# EAGLE design PCBFeeder_B_Board (EAGLE 8.4.3)
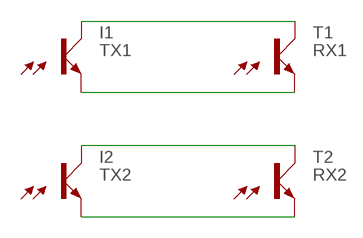
[diagram p0: schematic, sheet 1]

## Parts
I1  TX1  LTR-4206E  [DIODE_BREAKOUT]
I2  TX2  LTR-4206E  [DIODE_BREAKOUT]
T1  RX1  VEMT_2020_PHOTOTRANSISTOR  [VEMT2020_PHOTOTRANSISTOR]
T2  RX2  VEMT_2020_PHOTOTRANSISTOR  [VEMT2020_PHOTOTRANSISTOR]

## Nets
N$1: I1.A T1.A
N$2: I1.C T1.C
N$3: I2.A T2.A
N$4: I2.C T2.C

## Library data of the parts
I1 I2 = EE:LTR-4206E: Silicium NPN Phototransistor Source: Siemens; OC_FARNELL: unknown; OC_NEWARK: unknown
T1 T2 = EE:VEMT_2020_PHOTOTRANSISTOR

## Board
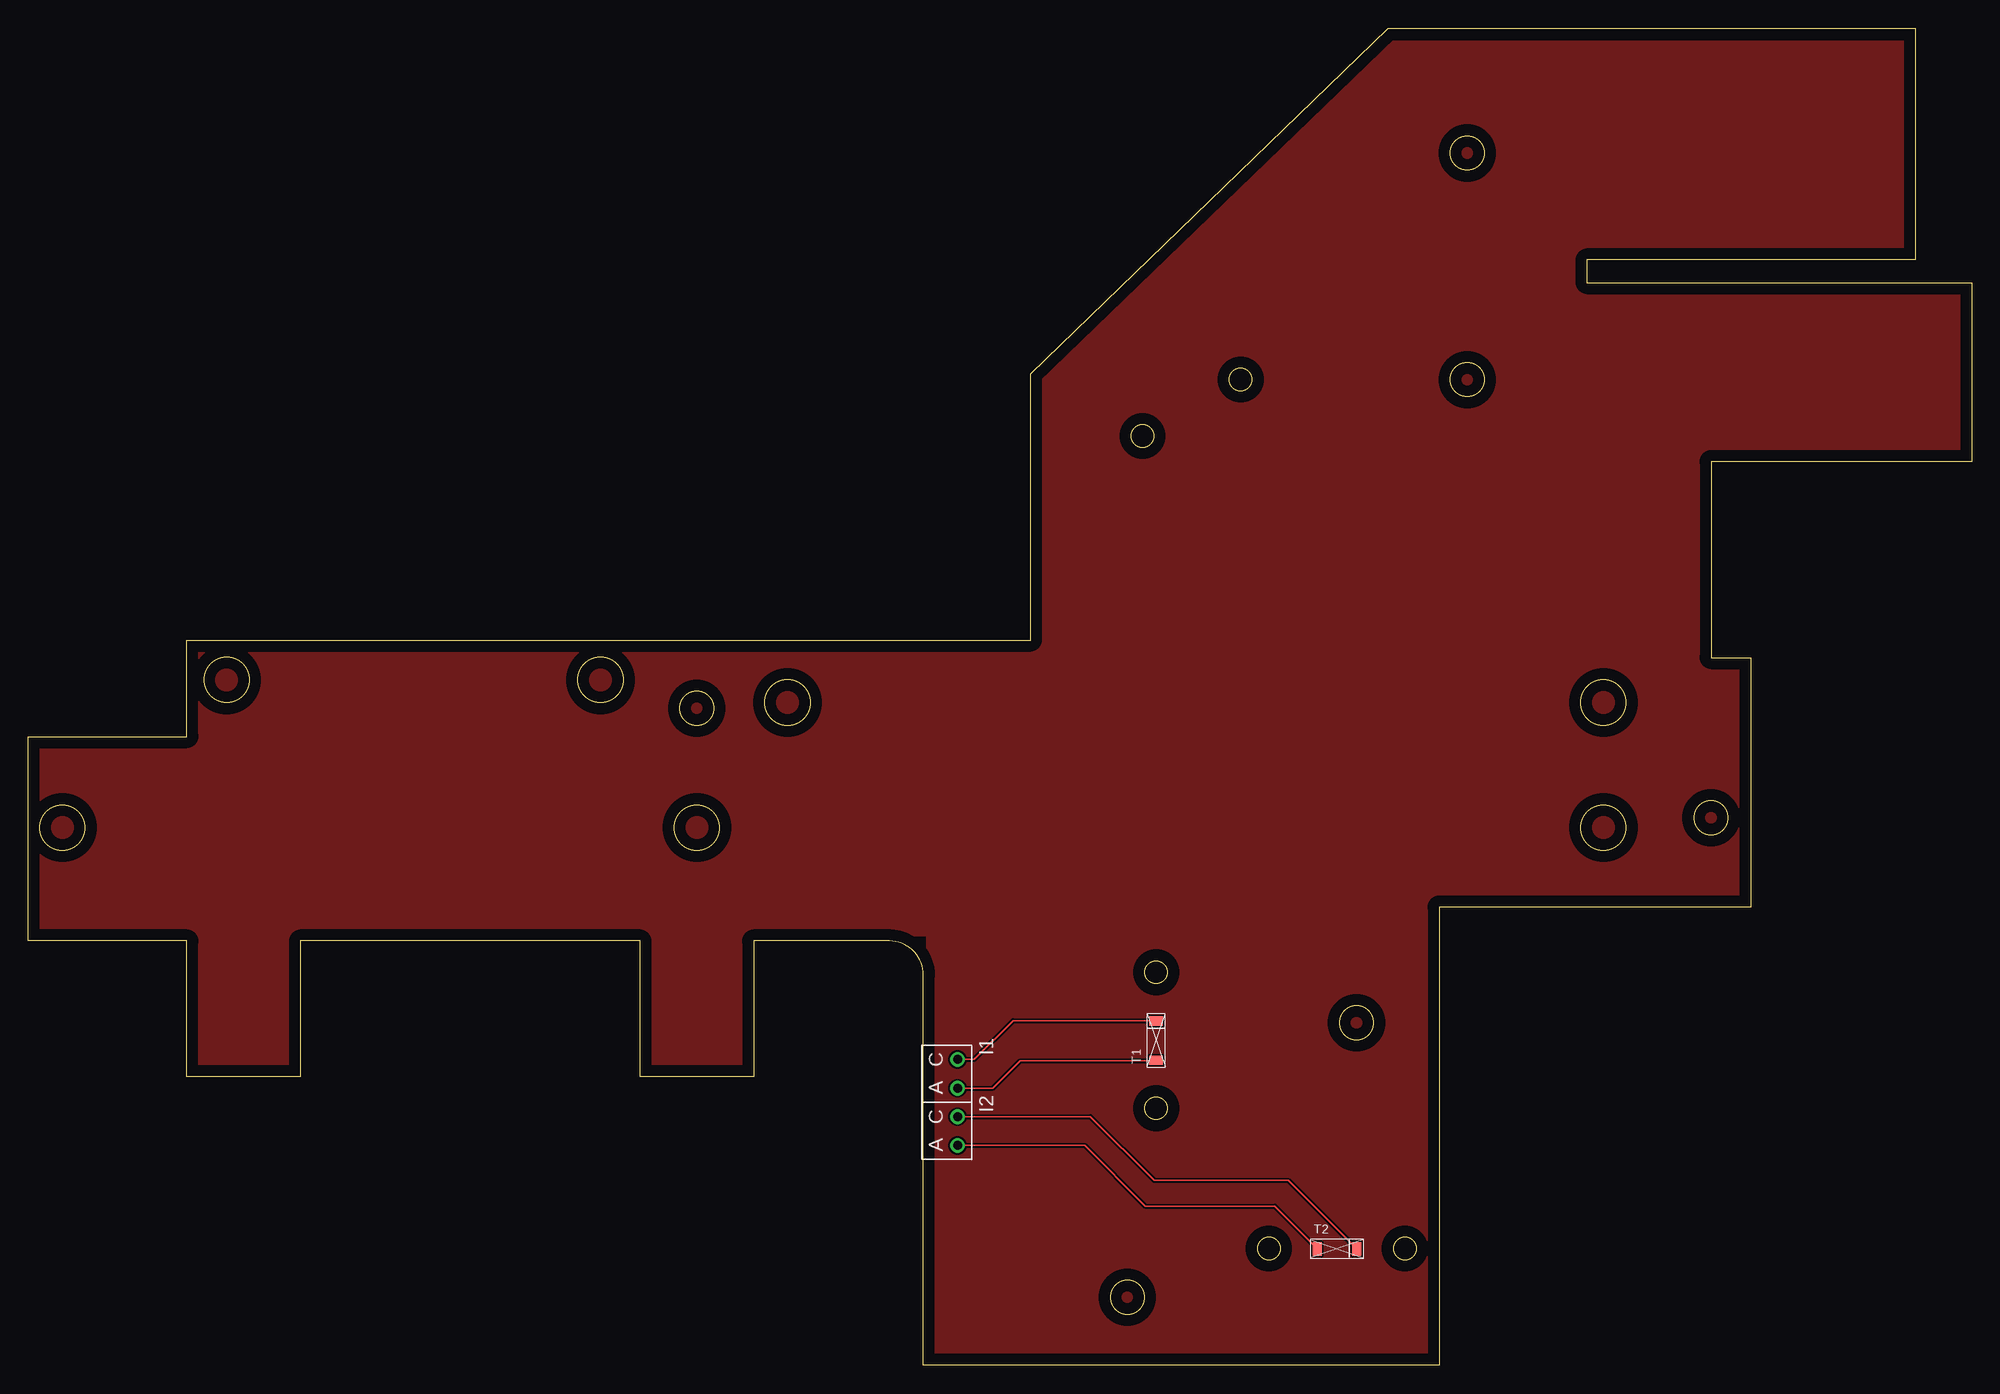
[diagram p1: board, top side]
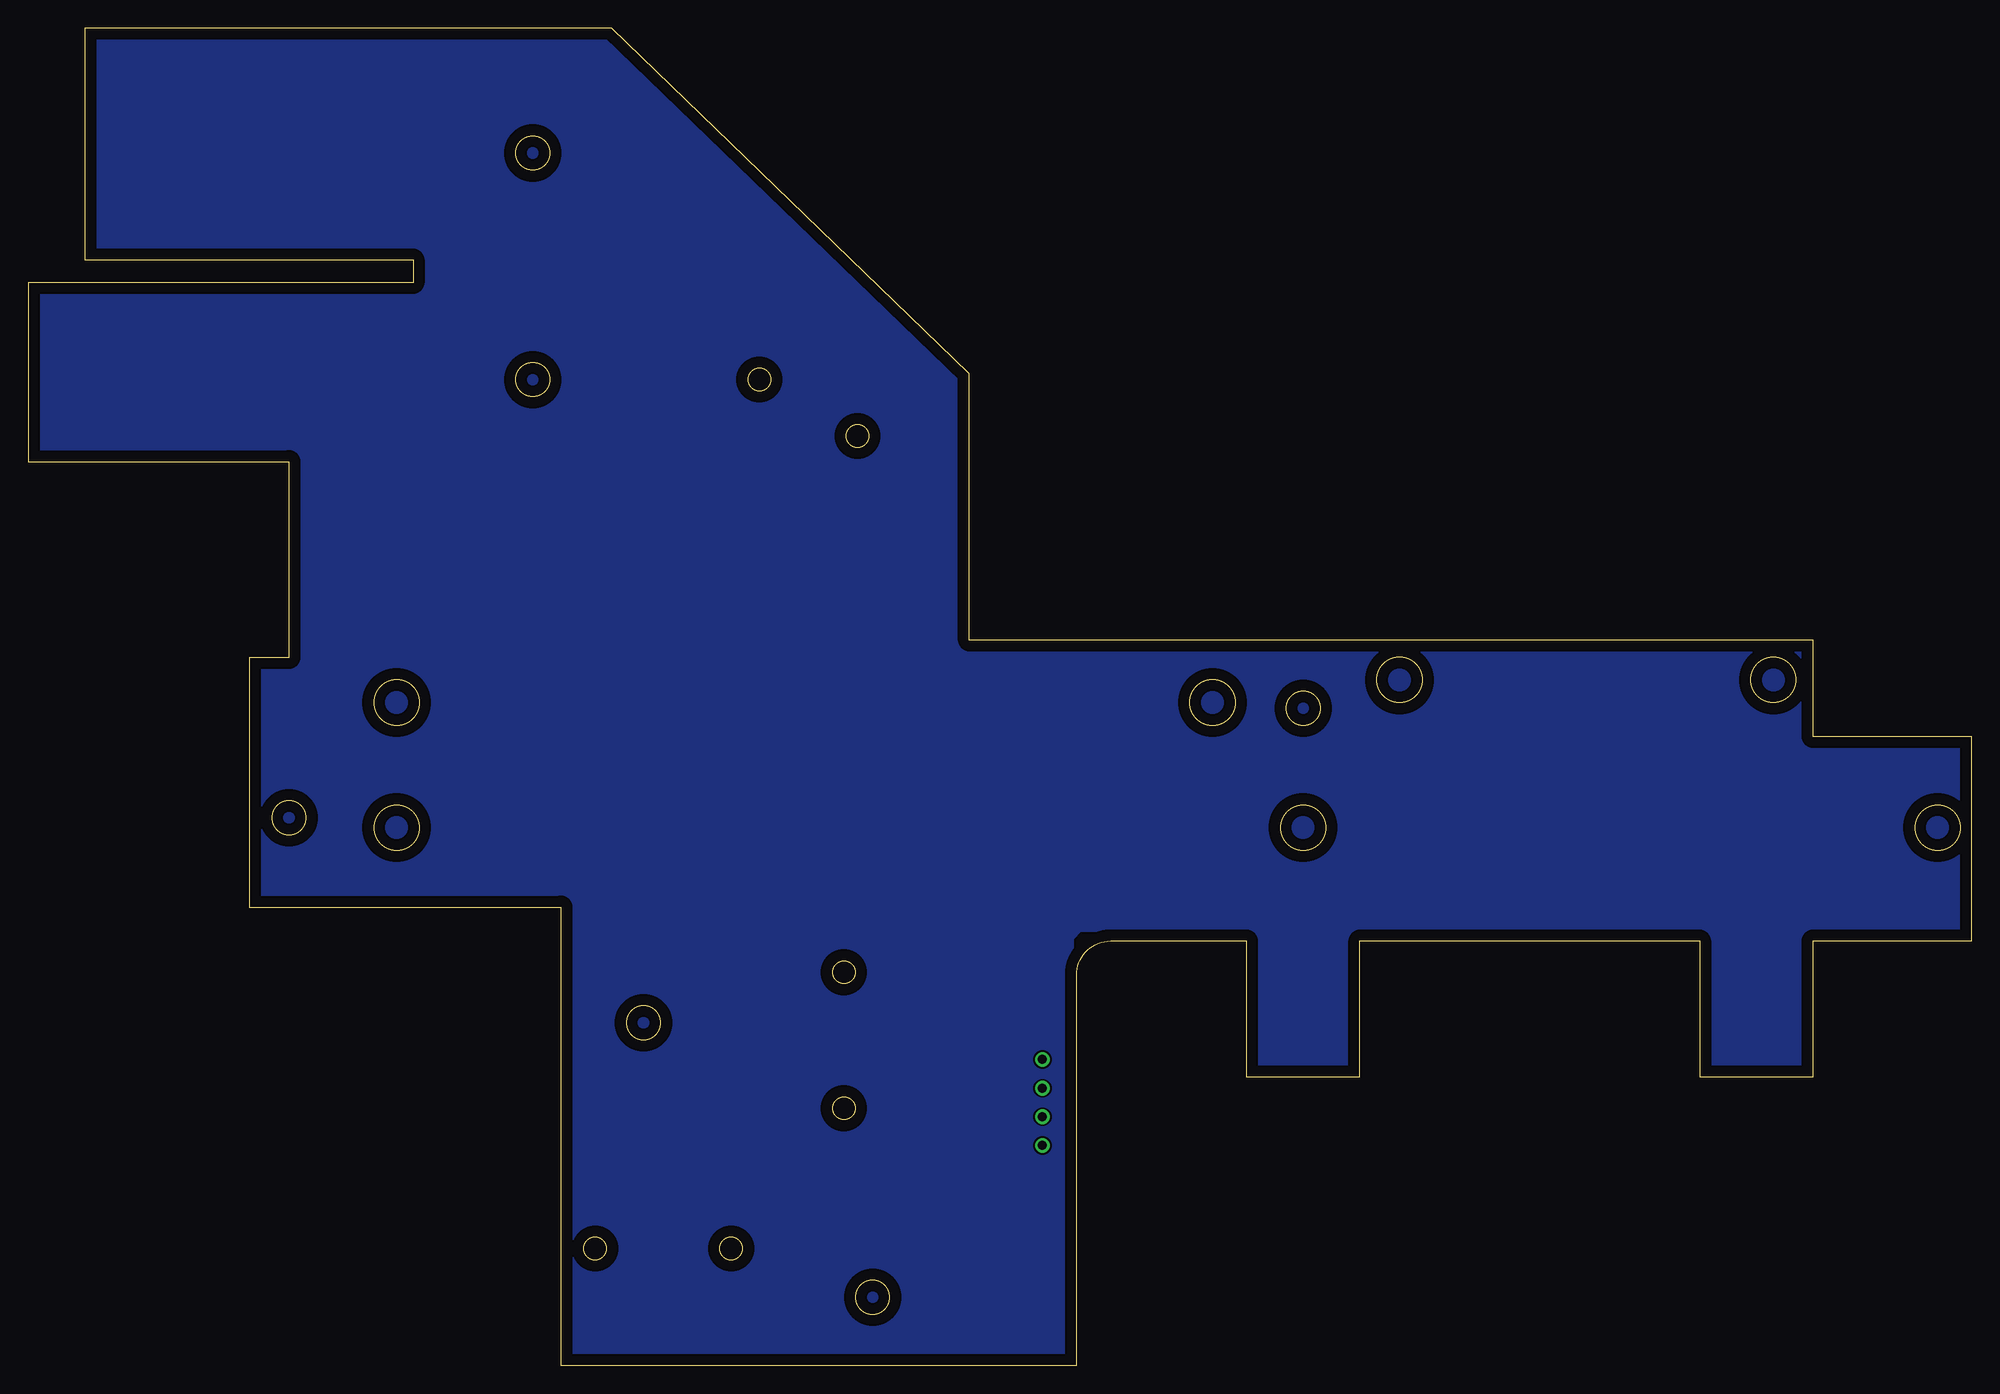
[diagram p2: board, bottom side, seen from below]

Size 171.51 x 118 mm. Coordinates in mm from the lower left corner, seen from the top.
Outline: 0,37.45 0,55.5 14,55.5 14,64 88.46,64 88.46,87.54 120,118 166.51,118 166.51,97.56 137.55,97.56 137.55,95.56 171.51,95.56 171.51,79.75 148.51,79.75 148.51,62.45 152,62.45 152,40.45 124.51,40.45 124.51,0 79,0 79,34.45 arc90 76,37.45 64,37.45 64,25.45 54,25.45 54,37.45 24,37.45 24,25.45 14,25.45 14,37.45 0,37.45
Outline: circle at 127,87 radius 1.5
Outline: circle at 127,107 radius 1.5
Outline: circle at 98.33,82.03 radius 1
Outline: circle at 107,87 radius 1
Outline: circle at 148.5,48.34 radius 1.5
Outline: circle at 67,58.5 radius 2
Outline: circle at 139,58.5 radius 2
Outline: circle at 17.5,60.5 radius 2
Outline: circle at 50.5,60.5 radius 2
Outline: circle at 59,58 radius 1.5
Outline: circle at 139,47.45 radius 2
Outline: circle at 59,47.45 radius 2
Outline: circle at 3,47.45 radius 2
Outline: circle at 99.53,22.69 radius 1
Outline: circle at 109.48,10.32 radius 1
Outline: circle at 99.53,34.69 radius 1
Outline: circle at 121.48,10.32 radius 1
Outline: circle at 117.22,30.24 radius 1.5
Outline: circle at 97,6 radius 1.5
Copper layers (1*16): Top 0.035mm / dielectric 1.5mm / Bottom 0.035mm
Design rules "default": minimum track width 6mil, minimum drill 0.35mm, track to track 6mil, track to pad 6mil, pad to pad 6mil, via to via 6mil, smd to smd 6mil, copper to edge 40mil, drill to drill 6mil, minimum pad ring 10mil, minimum via ring 8mil, stop-mask expansion 4mil, vias tented up to drill 0mil, thermal gap 10mil

### Footprints (pad centres in the part's own frame; a part is rotated, then mirrored left to right if it is on the bottom)
DIODE_BREAKOUT = drill 0.8 pad 1.3: A 2.54,2.54; C 0,2.54
VEMT2020_PHOTOTRANSISTOR = smd 0.8 x 1.2: A -0.9,0; C 2.551,0

### Placement (x,y rotation side)
I1  79.47,27 270 top
I2  79.47,21.95 270 top
T1  99.53,27.84 90 top
T2  114.67,10.29 0 top

### Tracks (layer width: path | path; a pad name or v marks a point on that pad's centre or on a via)
N$1
  Top 0.127: I1.A 85.13,24.46 87.54,26.87 99.47,26.87 T1.A
N$2
  Top 0.127: I1.C 83.48,27 86.91,30.43 99.49,30.43 T1.C
N$3
  Top 0.127: I2.A 93.23,19.41 98.59,14.05 110.01,14.05 T2.A
N$4
  Top 0.127: I2.C 93.74,21.95 99.36,16.33 111.18,16.33 T2.C
N$5
  pour Top: 14.01,25.6 14.01,37.54 0.04,37.54 0.04,55.45 14.01,55.45 14.01,63.96 88.69,63.96 88.69,87.2 120.18,117.55 166.16,117.55 166.16,97.87 137.33,97.74 137.33,94.95 171.24,94.95 171.24,80.09 148,80.09 148,62.05 151.68,62.05 151.68,40.59 124.12,40.72 124.12,0.2 79.29,0.2 79.29,37.92 63.8,37.92 63.67,25.86 54.14,25.86 54.14,37.8 23.79,37.8 23.79,25.6
N$6
  pour Bottom: 14.14,25.48 14.14,37.41 14.01,37.54 13.88,37.67 0.17,37.67 0.17,55.32 14.14,55.32 14.14,63.83 88.81,63.83 88.94,63.96 88.94,86.82 119.8,117.68 120.31,117.68 166.28,117.68 166.28,97.87 166.16,97.74 137.07,97.74 137.07,95.45 137.33,95.2 171.11,95.2 171.24,95.33 171.24,80.09 148.25,80.09 148.12,79.96 148.12,62.05 151.81,62.05 151.81,40.59 151.68,40.72 124.37,40.72 124.37,0.46 124.25,0.33 124.12,0.2 79.16,0.2 79.29,0.33 79.29,37.67 78.65,38.3 63.8,38.3 63.8,25.48 63.67,25.6 54.14,25.6 54.14,37.8 23.92,37.8 23.79,37.67 23.79,25.6 23.92,25.48